# EAGLE design D9X_v41 (EAGLE 6.4)
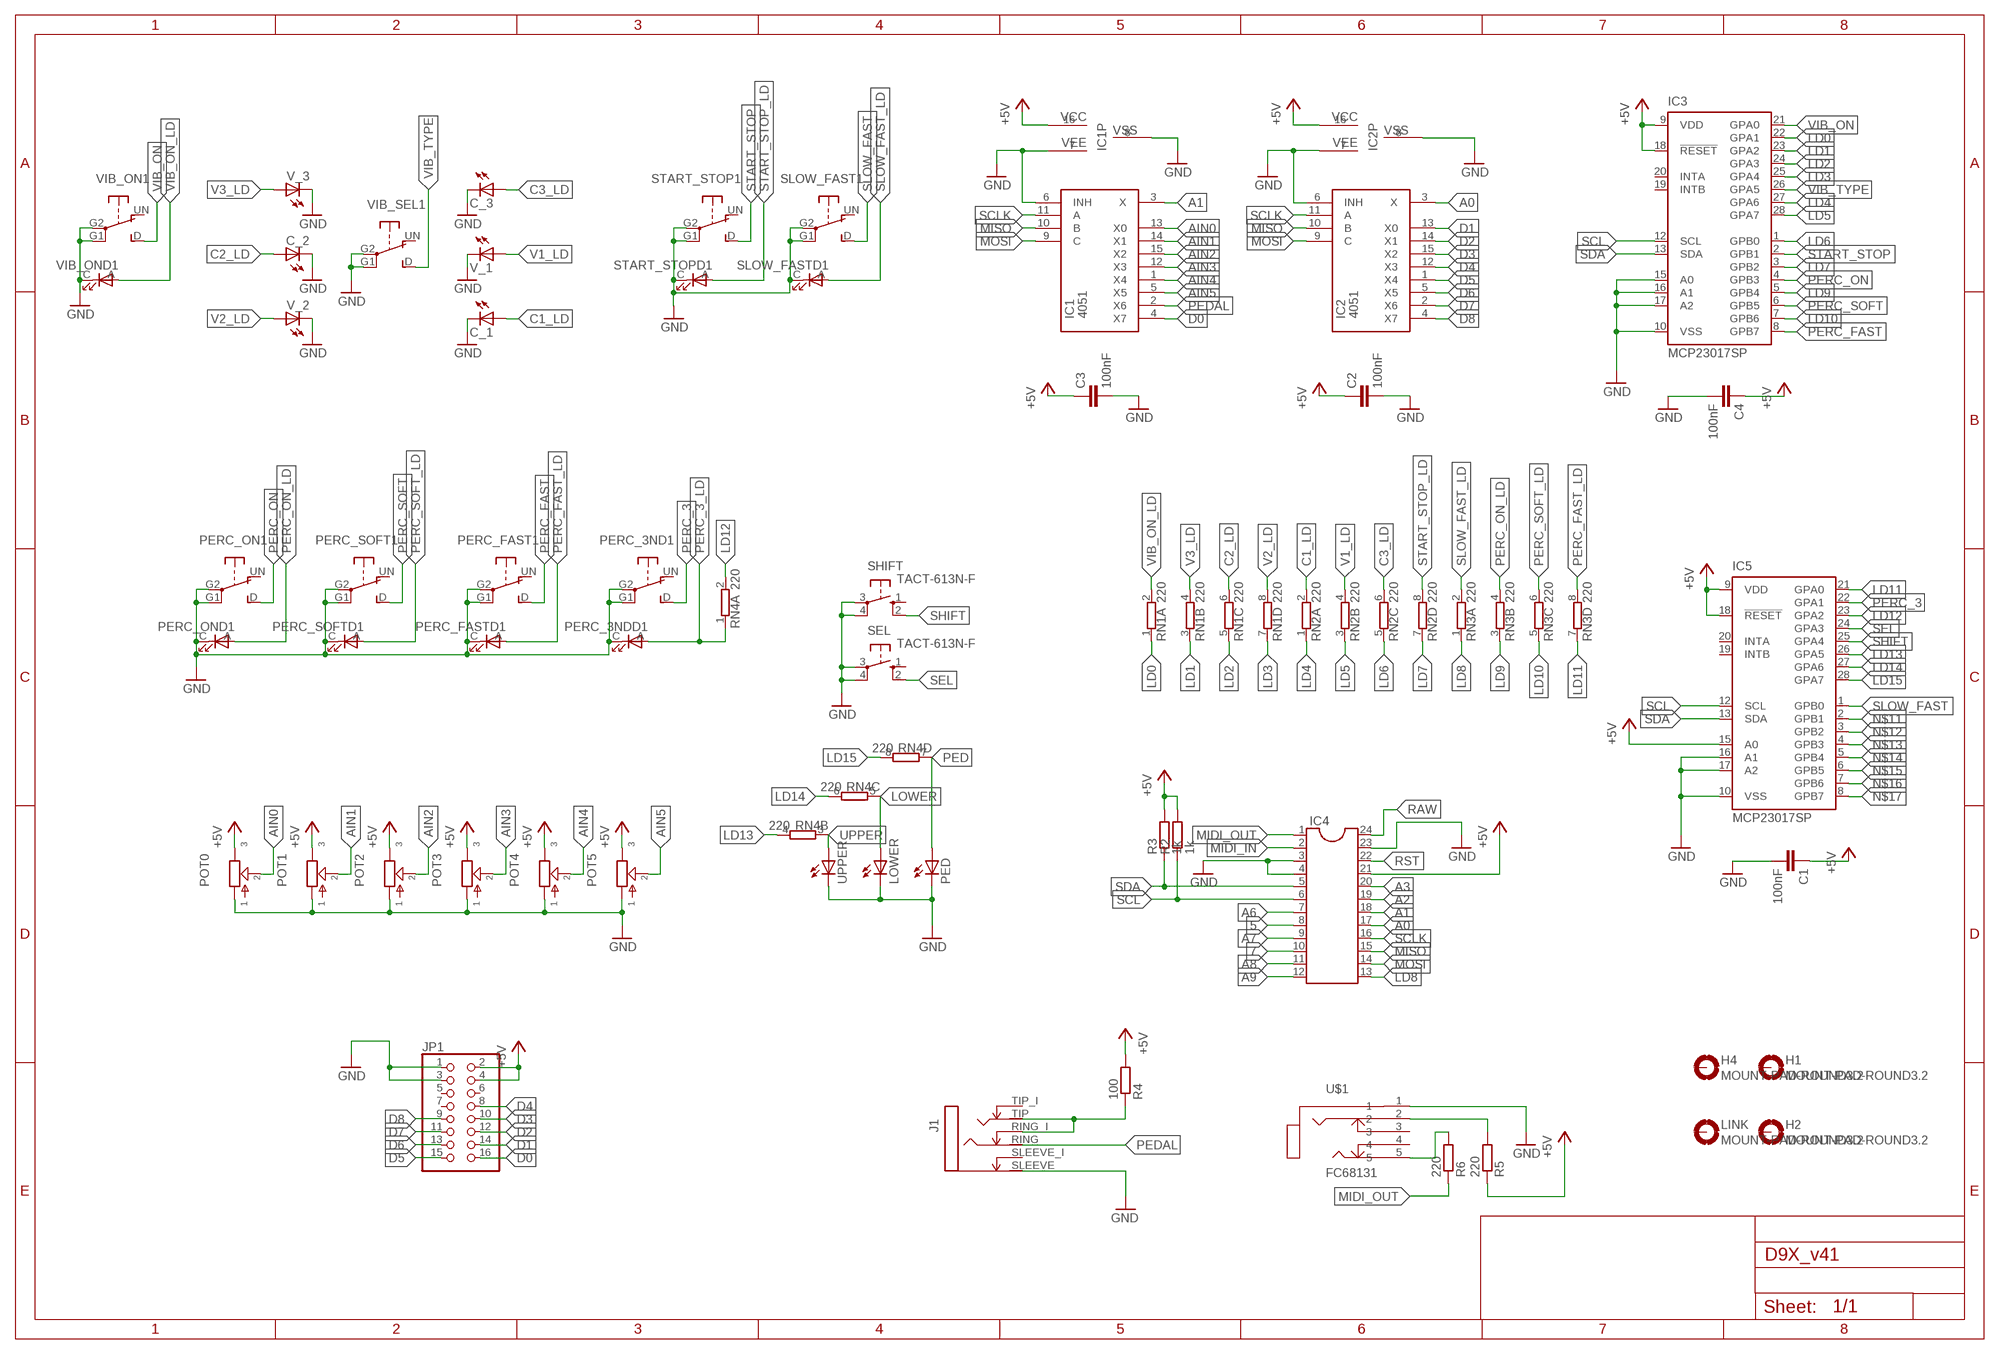
[diagram p0: schematic, sheet 1]

## Parts
C1  100nF  C-EU050-024X044  [C050-024X044]
C2  100nF  C-EU050-024X044  [C050-024X044]
C3  100nF  C-EU050-024X044  [C050-024X044]
C4  100nF  C-EU050-024X044  [C050-024X044]
C_1  LED3MM  [LED3MM]
C_2  LED3MM  [LED3MM]
C_3  LED3MM  [LED3MM]
H1  MOUNT-PAD-ROUND3.2  [3,2-PAD]
H2  MOUNT-PAD-ROUND3.2  [3,2-PAD]
H4  MOUNT-PAD-ROUND3.2  [3,2-PAD]
IC1  4051  [DIL16]
IC2  4051  [DIL16]
IC3  MCP23017SP  [DIL28-3]
IC4  DIL24-6  [DIL24-6]
IC5  MCP23017SP  [DIL28-3]
J1  STEREOSWJACK_ST_TRS_INT  [ST_JACK_TRS_INT]
JP1  PINHD-2X8  [2X08]
LINK  MOUNT-PAD-ROUND3.2  [3,2-PAD]
LOWER  LED3MM  [LED3MM]
PED  LED3MM  [LED3MM]
PERC_3ND  SRKLSHANPU  [SP86N-A1-5-01]
PERC_FAST  SRKLSHANPU  [SP86N-A1-5-01]
PERC_ON  SRKLSHANPU  [SP86N-A1-5-01]
PERC_SOFT  SRKLSHANPU  [SP86N-A1-5-01]
POT0  POT-EU12MM  [RV120DF-40B1-(L)K]
POT1  POT-EU12MM  [RV120DF-40B1-(L)K]
POT2  POT-EU12MM  [RV120DF-40B1-(L)K]
POT3  POT-EU12MM  [RV120DF-40B1-(L)K]
POT4  POT-EU12MM  [RV120DF-40B1-(L)K]
POT5  POT-EU12MM  [RV120DF-40B1-(L)K]
R2  1k  R-EU_0204/7  [0204/7]
R3  1k  R-EU_0204/7  [0204/7]
R4  100  R-EU_0204/7  [0204/7]
R5  220  R-EU_0204/7  [0204/7]
R6  220  R-EU_0204/7  [0204/7]
RN1  220  E4R  [SIL8]
RN2  220  E4R  [SIL8]
RN3  220  E4R  [SIL8]
RN4  220  E4R  [SIL8]
SEL  TACT-613N-F  10-XX  [B3F-10XX]
SHIFT  TACT-613N-F  10-XX  [B3F-10XX]
SLOW_FAST  SRKLSHANPU  [SP86N-A1-5-01]
START_STOP  SRKLSHANPU  [SP86N-A1-5-01]
U$1  FC68131  [FC68131-5P]
UPPER  LED3MM  [LED3MM]
V_1  LED3MM  [LED3MM]
V_2  LED3MM  [LED3MM]
V_3  LED3MM  [LED3MM]
VIB_ON  SRKLSHANPU  [SP86N-A1-5-01]
VIB_SEL  SRKLSHANPU  [SP86N-A1-5-01]

## Nets
5: IC4.8
7: IC4.10
+5V [5v]: C1.1 C2.1 C3.1 C4.1 IC1.16(VCC) IC2.16(VCC) IC3.9(VDD) IC3.18(!RESET) IC4.21 IC5.9(VDD) IC5.15(A0) IC5.18(!RESET) JP1.2 JP1.4 POT0.3 POT1.3 POT2.3 POT3.3 POT4.3 POT5.3 R2.2 R3.2 R4.2 R5.1
A0: IC2.3(X) IC4.17
A1: IC1.3(X) IC4.18
A2: IC4.19
A3: IC4.20
A6: IC4.7
A7: IC4.9
A8: IC4.11
A9: IC4.12
AIN0: IC1.13(X0) POT0.2
AIN1: IC1.14(X1) POT1.2
AIN2: IC1.15(X2) POT2.2
AIN3: IC1.12(X3) POT3.2
AIN4: IC1.1(X4) POT4.2
AIN5: IC1.5(X5) POT5.2
C1_LD: C_1.A RN2.2
C2_LD: C_2.A RN1.6
C3_LD: C_3.A RN2.6
D0: IC1.4(X7) JP1.16
D1: IC2.13(X0) JP1.14
D2: IC2.14(X1) JP1.12
D3: IC2.15(X2) JP1.10
D4: IC2.12(X3) JP1.8
D5: IC2.1(X4) JP1.15
D6: IC2.5(X5) JP1.13
D7: IC2.2(X6) JP1.11
D8: IC2.4(X7) JP1.9
GND [GND]: C1.2 C2.2 C3.2 C4.2 C_1.K(C) C_2.K(C) C_3.K(C) IC1.6(INH) IC1.7(VEE) IC1.8(VSS) IC2.6(INH) IC2.7(VEE) IC2.8(VSS) IC3.10(VSS) IC3.15(A0) IC3.16(A1) IC3.17(A2) IC4.3 IC4.4 IC4.23 IC5.10(VSS) IC5.16(A1) IC5.17(A2) J1.SLEEVE(S) JP1.1 JP1.3 LOWER.K(C) PED.K(C) PERC_3ND.C(D1:C) PERC_3ND.G1(1:P) PERC_3ND.G2(1:P) PERC_FAST.C(D1:C) PERC_FAST.G1(1:P) PERC_FAST.G2(1:P) PERC_ON.C(D1:C) PERC_ON.G1(1:P) PERC_ON.G2(1:P) PERC_SOFT.C(D1:C) PERC_SOFT.G1(1:P) PERC_SOFT.G2(1:P) POT0.1 POT1.1 POT2.1 POT3.1 POT4.1 POT5.1 SEL.3(P) SEL.4(P1) SHIFT.3(P) SHIFT.4(P1) SLOW_FAST.C(D1:C) SLOW_FAST.G1(1:P) SLOW_FAST.G2(1:P) START_STOP.C(D1:C) START_STOP.G1(1:P) START_STOP.G2(1:P) U$1.1 UPPER.K(C) V_1.K(C) V_2.K(C) V_3.K(C) VIB_ON.C(D1:C) VIB_ON.G1(1:P) VIB_ON.G2(1:P) VIB_SEL.G1(1:P) VIB_SEL.G2(1:P)
LD0: IC3.22(GPA1) RN1.1
LD1: IC3.23(GPA2) RN1.3
LD2: IC3.24(GPA3) RN1.5
LD3: IC3.25(GPA4) RN1.7
LD4: IC3.27(GPA6) RN2.1
LD5: IC3.28(GPA7) RN2.3
LD6: IC3.1(GPB0) RN2.5
LD7: IC3.3(GPB2) RN2.7
LD8: IC4.13 RN3.1
LD9: IC3.5(GPB4) RN3.3
LD10: IC3.7(GPB6) RN3.5
LD11: IC5.21(GPA0) RN3.7
LD12: IC5.23(GPA2) RN4.2
LD13: IC5.26(GPA5) RN4.4
LD14: IC5.27(GPA6) RN4.6
LD15: IC5.28(GPA7) RN4.8
LOWER: LOWER.A RN4.5
MIDI_IN: IC4.2
MIDI_OUT: IC4.1 R6.1
MISO: IC1.10(B) IC2.10(B) IC4.15
MOSI: IC1.9(C) IC2.9(C) IC4.14
N$1 [5v]: J1.RING_I(RN) J1.TIP(T) R4.1
N$3: R5.2 U$1.2
N$5: R6.2 U$1.5
N$11: IC5.2(GPB1)
N$12: IC5.3(GPB2)
N$13: IC5.4(GPB3)
N$14: IC5.5(GPB4)
N$15: IC5.6(GPB5)
N$16: IC5.7(GPB6)
N$17: IC5.8(GPB7)
PED: PED.A RN4.7
PEDAL: IC1.2(X6) J1.RING(R)
PERC_3: IC5.22(GPA1) PERC_3ND.D(1:S)
PERC_3_LD: PERC_3ND.A(D1:A) RN4.1
PERC_FAST: IC3.8(GPB7) PERC_FAST.D(1:S)
PERC_FAST_LD: PERC_FAST.A(D1:A) RN3.8
PERC_ON: IC3.4(GPB3) PERC_ON.D(1:S)
PERC_ON_LD: PERC_ON.A(D1:A) RN3.4
PERC_SOFT: IC3.6(GPB5) PERC_SOFT.D(1:S)
PERC_SOFT_LD: PERC_SOFT.A(D1:A) RN3.6
RAW: IC4.24
RST: IC4.22
SCL: IC3.12(SCL) IC4.6 IC5.12(SCL) R2.1
SCLK: IC1.11(A) IC2.11(A) IC4.16
SDA: IC3.13(SDA) IC4.5 IC5.13(SDA) R3.1
SEL: IC5.24(GPA3) SEL.2(S1)
SHIFT: IC5.25(GPA4) SHIFT.2(S1)
SLOW_FAST: IC5.1(GPB0) SLOW_FAST.D(1:S)
SLOW_FAST_LD: RN3.2 SLOW_FAST.A(D1:A)
START_STOP: IC3.2(GPB1) START_STOP.D(1:S)
START_STOP_LD: RN2.8 START_STOP.A(D1:A)
UPPER: RN4.3 UPPER.A
V1_LD: RN2.4 V_1.A
V2_LD: RN1.8 V_2.A
V3_LD: RN1.4 V_3.A
VIB_ON: IC3.21(GPA0) VIB_ON.D(1:S)
VIB_ON_LD: RN1.2 VIB_ON.A(D1:A)
VIB_TYPE: IC3.26(GPA5) VIB_SEL.D(1:S)
Unconnected: H1.B3,2(MOUNT) H2.B3,2(MOUNT) H4.B3,2(MOUNT) IC3.19(INTB) IC3.20(INTA) IC5.19(INTB) IC5.20(INTA) J1.SLEEVE_I(SN) J1.TIP_I(TN) JP1.5 JP1.6 JP1.7 LINK.B3,2(MOUNT) PERC_3ND.UN(1:O) PERC_FAST.UN(1:O) PERC_ON.UN(1:O) PERC_SOFT.UN(1:O) SEL.1(S) SHIFT.1(S) SLOW_FAST.UN(1:O) START_STOP.UN(1:O) U$1.3 U$1.4 VIB_ON.UN(1:O) VIB_SEL.A(D1:A) VIB_SEL.C(D1:C) VIB_SEL.UN(1:O)

## Library data of the parts
C1-C4 = rcl:C-EU: CAPACITOR, European symbol
C_1-C_3 LOWER PED UPPER V_1-V_3 = led:LED: LED OSRAM: - CHIPLED LG R971, LG N971, LY N971, LG Q971, LY Q971, LO R971, LY R971 LH N974, LH R974 LS Q976, LO Q976, LY Q976 LO Q996 - Hyper CHIPLED LW Q18S LB Q993, LB Q99A, LB R99A - SideLED LS A670, LO A670, LY A670, LG A670, LP A670 LB A673, LV A673, LT A673, LW A673 LH A674 LY A675 LS A676, LA A676, LO A676, LY A676, LW A676 LS A679, LY A679, LG A679 - Hyper Micro SIDELED® LS Y876, LA Y876, LO Y876, LY Y876 LT Y87S - SmartLED LW L88C, LW L88S LB L89C, LB L89S, LG L890 LS L89K, LO L89K, LY L89K LS L896, LA L896, LO L896, LY L896 - TOPLED LS T670, LO T670, LY T670, LG T670, LP T670 LSG T670, LSP T670, LSY T670, LOP T670, LYG T670 LG T671, LOG T671, LSG T671 LB T673, LV T673, LT T673, LW T673 LH T674 LS T676, LA T676, LO T676, LY T676, LB T676, LH T676, LSB T676, LW T676 LB T67C, LV T67C, LT T67C, LS T67K, LO T67K, LY T67K, LW E67C LS E67B, LA E67B, LO E67B, LY E67B, LB E67C, LV E67C, LT E67C LW T67C LS T679, LY T679, LG T679 LS T770, LO T770, LY T770, LG T770, LP T770 LB T773, LV T773, LT T773, LW T773 LH T774 LS E675, LA E675, LY E675, LS T675 LS T776, LA T776, LO T776, LY T776, LB T776 LHGB T686 LT T68C, LB T68C - Hyper Mini TOPLED® LB M676 - Mini TOPLED Santana® LG M470 LS M47K, LO M47K, LY M47K Source: http://www.osram.convergy.de LUXEON: - LUMILED® LXK2-PW12-R00, LXK2-PW12-S00, LXK2-PW14-U00, LXK2-PW14-V00 LXK2-PM12-R00, LXK2-PM12-S00, LXK2-PM14-U00 LXK2-PE12-Q00, LXK2-PE12-R00, LXK2-PE12-S00, LXK2-PE14-T00, LXK2-PE14-U00 LXK2-PB12-K00, LXK2-PB12-L00, LXK2-PB12-M00, LXK2-PB14-N00, LXK2-PB14-P00, LXK2-PB14-Q00 LXK2-PR12-L00, LXK2-PR12-M00, LXK2-PR14-Q00, LXK2-PR14-R00 LXK2-PD12-Q00, LXK2-PD12-R00, LXK2-PD12-S00 LXK2-PH12-R00, LXK2-PH12-S00 LXK2-PL12-P00, LXK2-PL12-Q00, LXK2-PL12-R00 Source: www.luxeon.com KINGBRIGHT: KA-3528ASYC Source: www.kingbright.com
H1 H2 H4 LINK = holes:MOUNT-PAD-ROUND: MOUNTING PAD, round
IC1 IC2 = atari:4051: 8-Channel Analog Multiplexer/Demultiplexer
IC3 IC5 = microchip:MCP23017: http://ww1.microchip.com/downloads/en/DeviceDoc/21952a.pdf Source: http://ww1.microchip.com/downloads/en/DeviceDoc/21952a.pdf; MF: MICROCHIP; MPN: MCP23017-E/SP; OC_FARNELL: 1332088; OC_NEWARK: 31K2959
IC4 = ic-package:DIL24: Dual In Line
J1 = jacks:STEREOSW
JP1 = pinhead:PINHD-2X8: PIN HEADER
PERC_3ND PERC_FAST PERC_ON PERC_SOFT SLOW_FAST START_STOP VIB_ON VIB_SEL = switch-misc:SRKL: SWITCH
POT0 POT1-POT5 = gm-pots:POT-EU
R2-R6 = rcl:R-EU_: RESISTOR, European symbol
RN1-RN4 = resistor-sil:E4R: SIL RESISTOR; OC_FARNELL: unknown; OC_NEWARK: unknown
SEL SHIFT = switch-omron:10-XX: OMRON SWITCH; MPN: B3F-1000; OC_FARNELL: 176432; OC_NEWARK: 36M3542
U$1 = con-cliff:FC68131

## Net classes
0 default: width 0.254 mm, drill 0.152 mm, clearance 0.254 mm
1 5v: width 0.508 mm, drill 0.152 mm, clearance 0.406 mm
2 GND: width 0.635 mm, drill 0.152 mm, clearance 0.635 mm

## Board
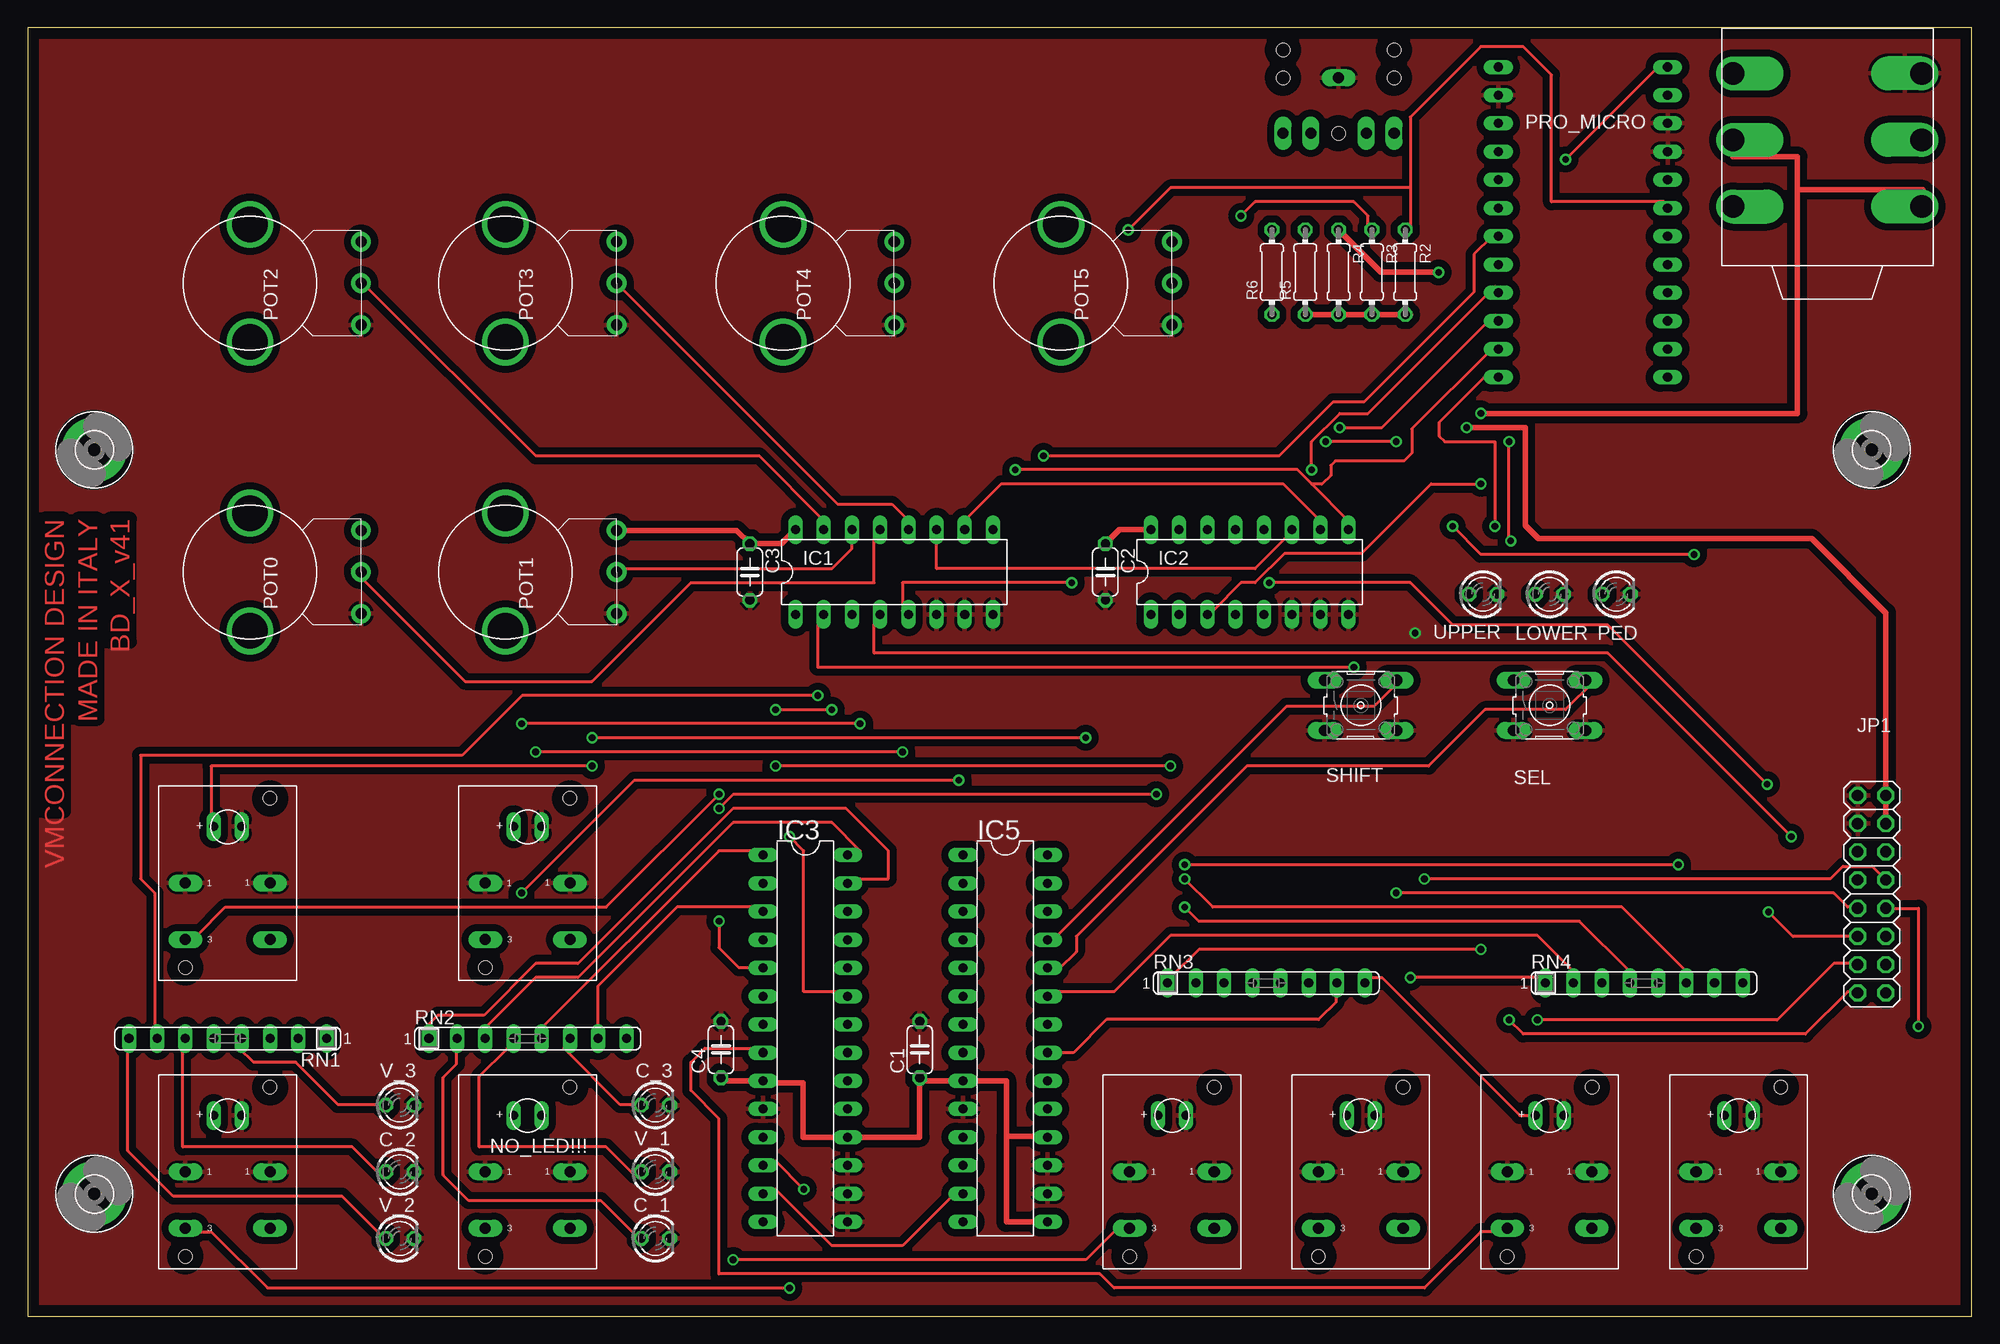
[diagram p1: board, top side]
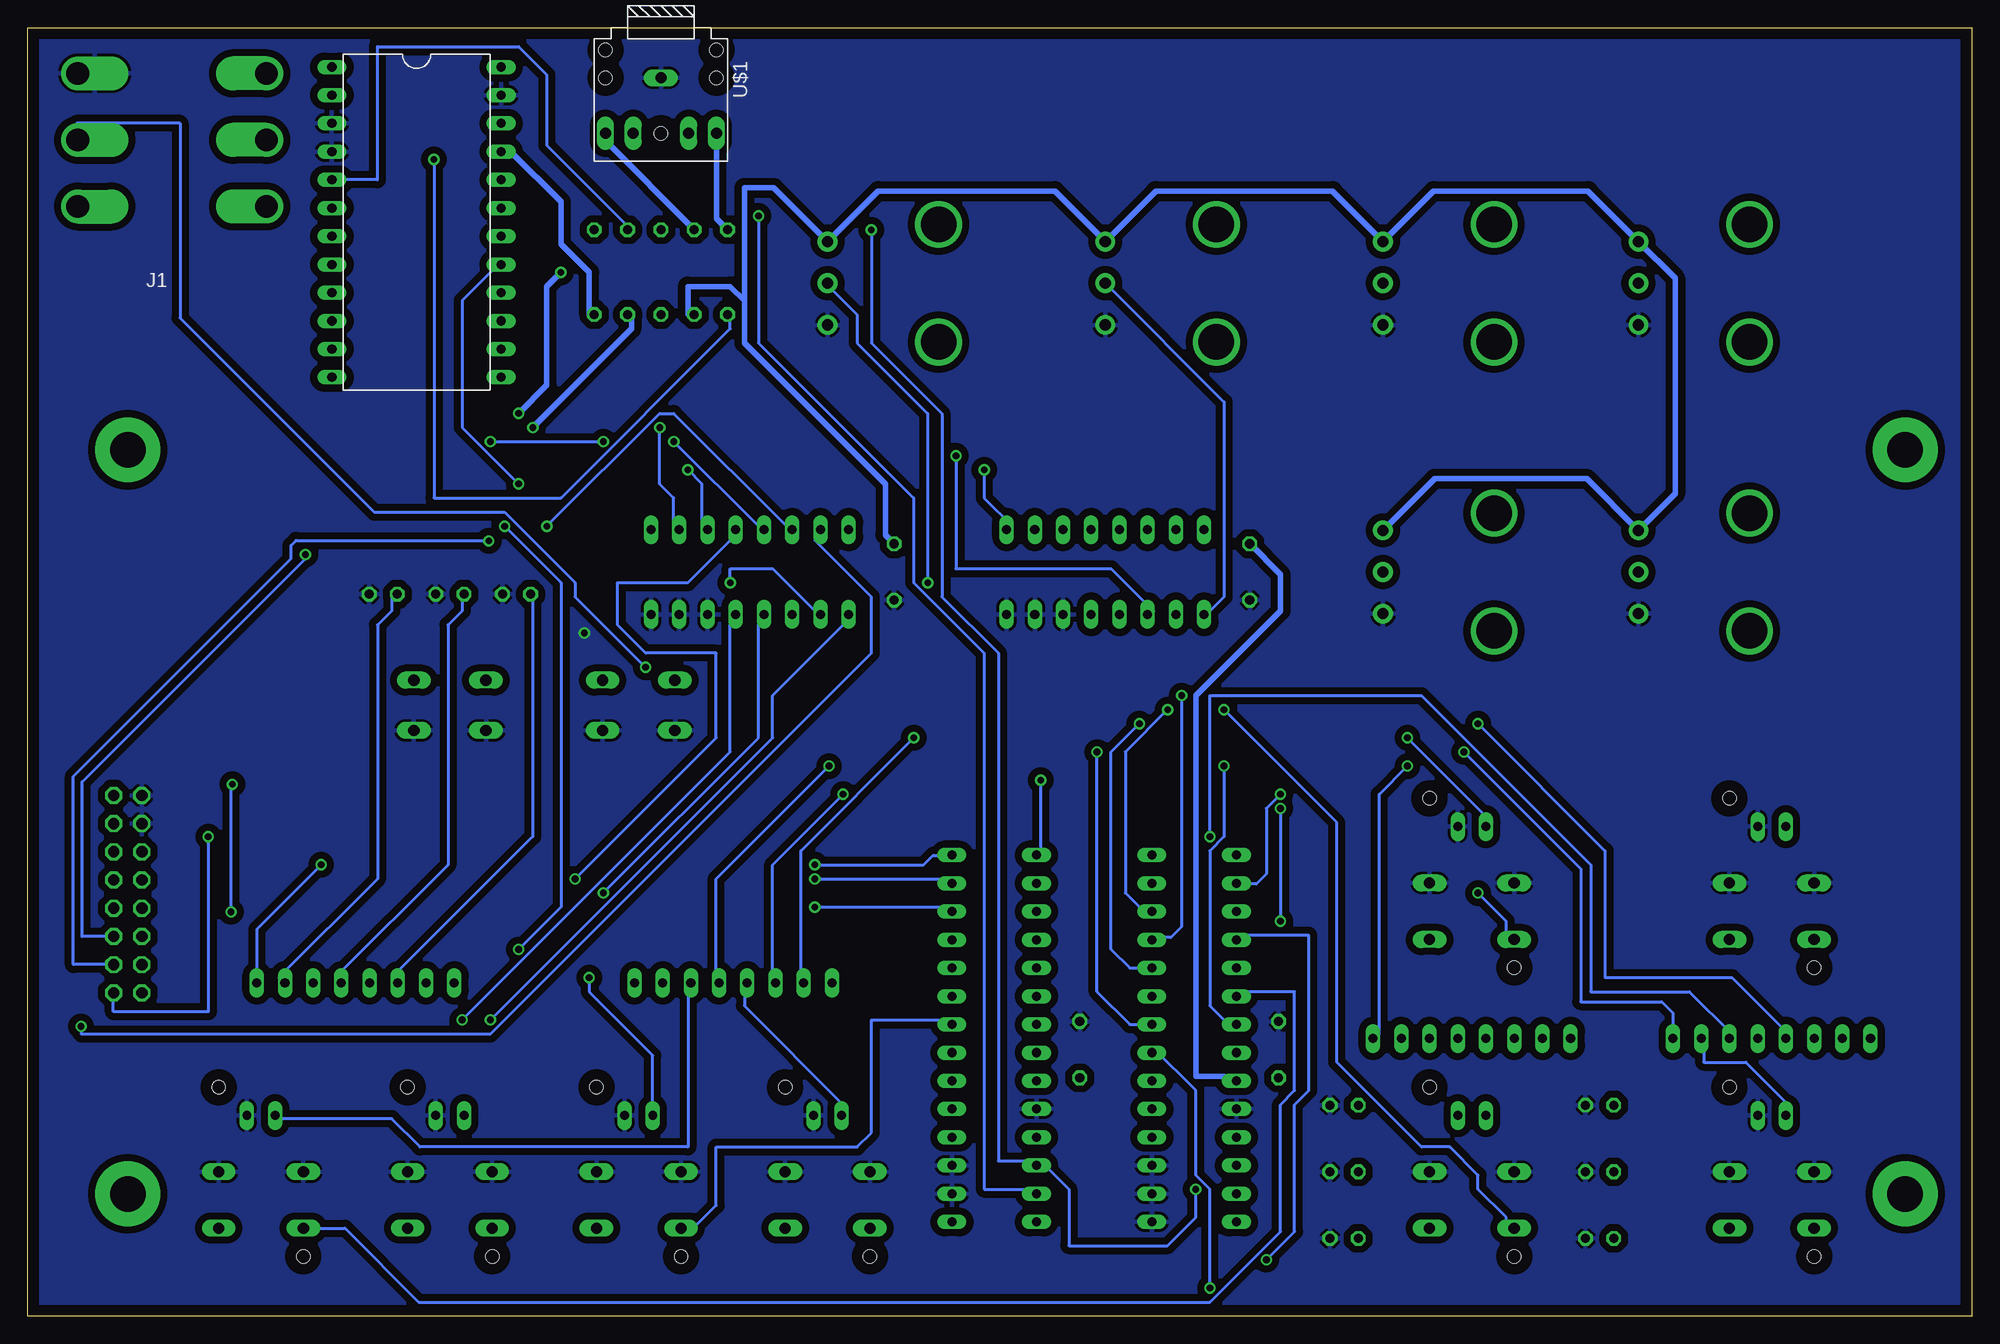
[diagram p2: board, bottom side, seen from below]

Size 175 x 116 mm. Coordinates in mm from the lower left corner, seen from the top.
Outline: 0,0 175,0 175,116 0,116 0,0
Copper layers (1*16): Top 0.035mm / dielectric 1.5mm / Bottom 0.035mm
Design rules "default": minimum track width 10mil, minimum drill 24mil, track to track 8mil, track to pad 8mil, pad to pad 8mil, via to via 8mil, smd to smd 8mil, copper to edge 40mil, drill to drill 8mil, minimum pad ring 10mil, minimum via ring 8mil, stop-mask expansion 4mil, vias tented up to drill 0mil, thermal gap 10mil

### Footprints (pad centres in the part's own frame; a part is rotated, then mirrored left to right if it is on the bottom)
C050-024X044 = drill 0.813 octagon: 1 -2.54,0; 2 2.54,0
LED3MM = drill 0.813 octagon: A -1.27,0; K 1.27,0
3,2-PAD = drill 3.2 pad 5.842: B3,2 0,0
DIL16 = drill 0.813 long: 1 -8.89,-3.81; 2 -6.35,-3.81; 3 -3.81,-3.81; 4 -1.27,-3.81; 5 1.27,-3.81; 6 3.81,-3.81; 7 6.35,-3.81; 8 8.89,-3.81; 9 8.89,3.81; 10 6.35,3.81; 11 3.81,3.81; 12 1.27,3.81; 13 -1.27,3.81; 14 -3.81,3.81; 15 -6.35,3.81; 16 -8.89,3.81
DIL28-3 = drill 0.813 long: 1 -16.51,-3.81; 2 -13.97,-3.81; 3 -11.43,-3.81; 4 -8.89,-3.81; 5 -6.35,-3.81; 6 -3.81,-3.81; 7 -1.27,-3.81; 8 1.27,-3.81; 9 3.81,-3.81; 10 6.35,-3.81; 11 8.89,-3.81; 12 11.43,-3.81; 13 13.97,-3.81; 14 16.51,-3.81; 15 16.51,3.81; 16 13.97,3.81; 17 11.43,3.81; 18 8.89,3.81; 19 6.35,3.81; 20 3.81,3.81; 21 1.27,3.81; 22 -1.27,3.81; 23 -3.81,3.81; 24 -6.35,3.81; 25 -8.89,3.81; 26 -11.43,3.81; 27 -13.97,3.81; 28 -16.51,3.81
DIL24-6 = drill 0.813 long: 1 -13.97,-7.62; 2 -11.43,-7.62; 3 -8.89,-7.62; 4 -6.35,-7.62; 5 -3.81,-7.62; 6 -1.27,-7.62; 7 1.27,-7.62; 8 3.81,-7.62; 9 6.35,-7.62; 10 8.89,-7.62; 11 11.43,-7.62; 12 13.97,-7.62; 13 13.97,7.62; 14 11.43,7.62; 15 8.89,7.62; 16 6.35,7.62; 17 3.81,7.62; 18 1.27,7.62; 19 -1.27,7.62; 20 -3.81,7.62; 21 -6.35,7.62; 22 -8.89,7.62; 23 -11.43,7.62; 24 -13.97,7.62
ST_JACK_TRS_INT = drill 2.032 offset: RING 8.5,0; RING_I -8.5,0; SLEEVE 8.5,-6; SLEEVE_I -8.5,-6; TIP 8.5,6; TIP_I -8.5,6
2X08 = drill 1.016 octagon: 1 -8.89,-1.27; 2 -8.89,1.27; 3 -6.35,-1.27; 4 -6.35,1.27; 5 -3.81,-1.27; 6 -3.81,1.27; 7 -1.27,-1.27; 8 -1.27,1.27; 9 1.27,-1.27; 10 1.27,1.27; 11 3.81,-1.27; 12 3.81,1.27; 13 6.35,-1.27; 14 6.35,1.27; 15 8.89,-1.27; 16 8.89,1.27
SP86N-A1-5-01 = drill 0.8 long: A -1.27,5.08; C 1.27,5.08 | drill 1 long: D -3.81,-5.08; G1 -3.81,0; G2 3.81,0; UN 3.81,-5.08 | hole 1.2: 3.81,7.62; -3.81,-7.62
RV120DF-40B1-(L)K = drill 1 pad 1.778: 1 -3.75,-10; 2 0,-10; 3 3.75,-10 | drill 3.2: P$4 -5.3,0; P$5 5.3,0
0204/7 = drill 0.813 octagon: 1 -3.81,0; 2 3.81,0
SIL8 = drill 0.813 long: 1 -8.89,0; 2 -6.35,0; 3 -3.81,0; 4 -1.27,0; 5 1.27,0; 6 3.81,0; 7 6.35,0; 8 8.89,0
B3F-10XX = drill 1.016 long: 1 -3.251,2.261; 2 3.251,2.261; 3 -3.251,-2.261; 4 3.251,-2.261
FC68131-5P = drill 1 long: 1 -5,0; 2 0,-5; 3 0,-2.5; 4 0,2.5; 5 0,5 | hole 1.2: 0,0; -5,-5; -5,5; -7.5,5; -7.5,-5

### Placement (x,y rotation side)
C1  80.3,24 90 top
C2  97,67 270 top
C3  65,67 270 top
C4  62.4,24 90 top
C_1  56.5,7 0 top
C_2  33.5,13 0 top
C_3  56.5,19 0 top
H1  6,11 0 top
H2  166,11 0 top
H4  6,78 0 top
IC1  78,67 0 top
IC2  110,67 0 top
IC3  70,25 270 top
IC4  140,98.5 270 bottom
IC5  88,25 270 top
J1  162,105.9 180 bottom
JP1  166,38 270 top
LINK  166,78 0 top
LOWER  137,65 0 top
PED  143,65 0 top
PERC_3ND  120,13 0 top
PERC_FAST  137,13 0 top
PERC_ON  103,13 0 top
PERC_SOFT  154,13 0 top
POT0  20,67 90 top
POT1  43,67 90 top
POT2  20,93 90 top
POT3  43,93 90 top
POT4  68,93 90 top
POT5  93,93 90 top
R2  124,94 270 top
R3  121,94 270 top
R4  118,94 270 top
R5  115,94 90 top
R6  112,94 90 top
RN1  18,25 180 top
RN2  45,25 0 top
RN3  111.5,30 0 top
RN4  145.5,30 0 top
SEL  137,55 0 top
SHIFT  120,55 0 top
SLOW_FAST  45,39 0 top
START_STOP  18,39 0 top
U$1  118,106.5 270 bottom
UPPER  131,65 0 top
V_1  56.5,13 0 top
V_2  33.5,7 0 top
V_3  33.5,19 0 top
VIB_ON  18,13 0 top
VIB_SEL  45,13 0 top

### Tracks (layer width: path | path; a pad name or v marks a point on that pad's centre or on a via)
+5V  (via drill 0.61)
  Top 0.508: 118.11,90.17 115.57,90.17 R5.1 | 118.11,90.17 120.65,90.17 | 118.11,90.17 R4.2 | 120.65,90.17 124.46,90.17 R2.2 | 120.65,90.17 R3.2 | v129.54,80.01 134.8,80.01 134.8,71.2 136,70 160.6,70 167.27,63.33 JP1.2 JP1.4 | C4.1 62.67,21.19 IC3.9 66.19,21 69.8,21 69.8,16.11 IC3.18 80.3,16.11 C1.1 80.3,21.19 IC5.9 88.1,21.19 88.1,16.2 | 88.1,16.2 91.81,16.2 IC5.18 | IC5.15 88.1,8.49 88.1,16.2 | IC2.16 98.27,70.81 C2.1 | 64.9,69.64 C3.1 | IC1.16 67.84,69.54 C3.1 | POT1.3 63.79,70.75 C3.1
  Bottom 0.508: R2.2 124.46,90.17 124.46,93.98 127,96.52 127,100.33 131.52,104.85 IC4.21 | v129.54,80.01 120.65,88.9 120.65,90.17 R3.2 | 110.49,91.44 110.49,87.63 97.79,74.93 97.79,70.33 C2.1 | 110.49,91.44 111.76,92.71 115.57,92.71 115.57,90.17 R5.1 | 110.49,91.44 110.49,101.6 107.85,101.6 POT5.3 98.45,101.3 82.55,101.3 POT4.3 73.45,101.3 57.55,101.3 POT3.3 48.45,101.3 34.55,101.3 POT2.3 26.7,93.45 26.7,74.05 POT0.3 34.65,75.4 48.35,75.4 POT1.3 | IC3.9 67.31,21.59 69.85,21.59 69.85,55.88 62.23,63.5 62.23,66.77 C3.1
A0  (via drill 0.61)
  Top 0.254: IC2.3 106.68,63.5 109.22,66.04 110.49,66.04 113.15,68.7 120.1,68.7 126.33,74.93 v130.81,74.93
  Bottom 0.254: v130.81,74.93 135.89,80.01 135.89,91.44 132.64,94.69 IC4.17
A1  (via drill 0.61)
  Top 0.254: v91.44,77.47 112.67,77.47 117.5,82.3 120.3,82.3 130.2,92.2 130.2,95.6 131.8,97.2 132.35,97.2 IC4.18
  Bottom 0.254: v91.44,77.47 91.44,67.31 77.47,67.31 73.66,63.5 IC1.3
AIN0
  Top 0.254: IC1.13 76.2,69.85 76.2,66.04 59.69,66.04 50.8,57.15 39.37,57.15 29.21,67.31 POT0.2
AIN1
  Top 0.254: POT1.2 53.34,67.31 72.39,67.31 74.19,69.11 IC1.14
AIN2
  Top 0.254: POT2.2 30.48,92.71 45.72,77.47 65.83,77.47 71.65,71.65 IC1.15
AIN3
  Top 0.254: POT3.2 72.9,73.1 77.8,73.1 79.27,71.63 IC1.12
AIN4
  Bottom 0.254: IC1.1 68.58,63.5 67.31,64.77 67.31,82.31 POT4.2
AIN5  (via drill 0.61)
  Top 0.254: v93.98,66.04 78.74,66.04 78.74,63.5 IC1.5
  Bottom 0.254: v93.98,66.04 93.98,81.28 100.33,87.63 100.33,90.17 102.87,92.71 POT5.2
C1_LD
  Top 0.254: C_1.A 55,7 51.6,10.4 39.7,10.4 37.4,12.7 37.4,21.5 38.6,22.7 38.6,24.95 RN2.2
C2_LD
  Top 0.254: RN1.6 13.97,24.13 13.97,15.24 29.21,15.24 31.75,12.7 C_2.A
C3_LD
  Top 0.254: RN2.6 48.26,24.13 53.34,19.05 54.61,19.05 C_3.A
D0  (via drill 0.61)
  Top 0.254: v158.75,43.18 142.24,59.69 76.2,59.69 76.2,62.23 IC1.4
  Bottom 0.254: v158.75,43.18 158.75,27.4 167.3,27.4 167.3,29.11 JP1.16
D1  (via drill 0.6, 0.61)
  Top 0.254: v123.19,78.74 v116.84,78.74 | v133.5,69.8 133.35,69.8 v133.35,78.74
  Bottom 0.254: v116.84,78.74 109.22,71.12 IC2.13 | v133.35,78.74 v123.19,78.74 | v133.5,69.8 133.5,69.85 150.85,69.85 151.3,69.4 151.3,68.2 170.9,48.6 170.9,31.65 JP1.14
D2  (via drill 0.61)
  Top 0.254: v128.27,71.12 130.81,68.58 v150,68.58
  Bottom 0.254: v128.27,71.12 118.11,81.28 116.84,81.28 106.68,71.12 IC2.14 | JP1.12 170.1,34.19 170.1,48.1 150,68.2 v150,68.58
D3  (via drill 0.6)
  Top 0.254: JP1.10 170.2,36.73 v170.2,26.1
  Bottom 0.254: IC2.15 104.14,69.85 99.06,64.77 99.06,59.69 133.35,25.4 170.18,25.4 170.2,25.42 v170.2,26.1
D4  (via drill 0.61)
  Top 0.254: v125.73,39.37 162.27,39.37 163.4,40.5 166.04,40.5 JP1.8
  Bottom 0.254: v125.73,39.37 113.03,52.07 113.03,59.69 119.38,59.69 121.92,62.23 121.92,66.04 115.57,66.04 111.76,69.85 IC2.12
D5  (via drill 0.61)
  Top 0.254: v133.35,26.67 134.62,25.4 160.02,25.4 163.83,29.21 165.1,29.21 JP1.15
  Bottom 0.254: v133.35,26.67 107.95,52.07 107.95,55.88 101.6,62.23 IC2.1
D6  (via drill 0.61)
  Top 0.254: v135.89,26.67 157.48,26.67 162.56,31.75 165.1,31.75 JP1.13
  Bottom 0.254: v135.89,26.67 111.76,50.8 111.76,62.23 IC2.5
D7  (via drill 0.6, 0.61)
  Top 0.254: v111.76,66.04 124.46,66.04 128.27,62.23 142.24,62.23 v156.59,47.88 156.78,47.69 | JP1.11 158.91,34.19 v156.7,36.4
  Bottom 0.254: v111.76,66.04 111.76,67.31 107.95,67.31 104.14,63.5 IC2.2 | v156.7,36.4 156.7,47.77 v156.59,47.88
D8  (via drill 0.61)
  Top 0.254: v123.19,38.1 162.56,38.1 163.83,36.83 165.1,36.83 JP1.9
  Bottom 0.254: v123.19,38.1 109.22,52.07 109.22,62.23 IC2.4
GND  (via drill 0.6)
  other vias: 124.9,61.5
  pour Top (isolate 0.406): 0,0 175,0 175,116 0,116
  pour Bottom (isolate 0.406): 0,0 175,0 175,116 0,116
LD0  (via drill 0.61)
  Top 0.254: v78.74,50.8 v45.72,50.8
  Bottom 0.254: v45.72,50.8 35.2,40.28 35.2,28.3 27.9,28.3 26.9,27.3 RN1.1 | v78.74,50.8 78.74,29.21 75.8,26.27 IC3.22
LD1  (via drill 0.61)
  Top 0.254: v68.58,43.18 69.85,41.91 69.85,29.21 73.66,29.21 IC3.23
  Bottom 0.254: v68.58,43.18 68.58,55.88 49.53,55.88 34.29,40.64 34.29,29.21 25.4,29.21 21.59,25.4 RN1.3
LD2  (via drill 0.61)
  Top 0.254: v74.93,53.34 v44.45,53.34
  Bottom 0.254: v44.45,53.34 33.02,41.91 33.02,30.48 21.59,30.48 16.51,25.4 RN1.5 | v74.93,53.34 77.47,50.8 77.47,33.02 75.8,31.35 IC3.24
LD3  (via drill 0.61)
  Top 0.254: RN1.7 11.43,25.4 11.43,38.1 10.16,39.37 10.16,50.5 39.1,50.5 44.48,55.88 v71.12,55.88
  Bottom 0.254: v71.12,55.88 71.12,35.08 72.1,34.1 73.6,34.1 IC3.25
LD4
  Top 0.254: IC3.27 74.93,39.37 77.47,39.37 77.47,41.91 73.66,45.72 63.5,45.72 49.53,31.75 45.72,31.75 41.07,27.1 36.9,27.1 36.11,26.31 RN2.1
LD5
  Top 0.254: RN2.3 40.64,25.4 45.72,30.48 49.53,30.48 63.5,44.45 72.39,44.45 74.93,41.91 IC3.28
LD6
  Top 0.254: RN2.5 45.72,25.4 62.23,41.91 66.04,41.91 IC3.1
LD7
  Top 0.254: IC3.3 66.04,36.83 58.43,36.83 51.35,29.75 RN2.7
LD8  (via drill 0.61)
  Top 0.254: v130.81,33.02 105.41,33.02 102.87,30.48 RN3.1 | v132.08,71.12 132.08,78.74 127.56,78.74 127.1,79.2 127.1,80.5 131.13,84.53 IC4.13
  Bottom 0.254: v130.81,33.02 127,36.83 127,66.04 v132.08,71.12
LD9  (via drill 0.61)
  Top 0.254: v62.23,45.72 63.5,46.99 v101.6,46.99 | v62.23,35.56 62.23,33.17 64,31.4 66.14,31.4 IC3.5
  Bottom 0.254: v62.23,45.72 v62.23,35.56 | v101.6,46.99 107.95,40.64 107.95,30.48 RN3.3
LD10  (via drill 0.61)
  Top 0.254: v102.87,49.53 v67.31,49.53
  Bottom 0.254: v67.31,49.53 67.31,43.18 68.58,41.91 68.58,27.94 67.31,26.67 IC3.7 | v102.87,49.53 113.03,39.37 113.03,30.48 RN3.5
LD11
  Top 0.254: RN3.7 117.8,29.95 117.8,28.3 116.2,26.7 97.1,26.7 94.13,23.73 IC5.21
LD12
  Top 0.254: IC5.23 92.71,29.21 97.79,29.21 102.87,34.29 135.89,34.29 139.15,31.03 RN4.2
LD13  (via drill 0.61)
  Top 0.254: v104.14,36.83 105.41,35.56 139.7,35.56 144.23,31.03 RN4.4
  Bottom 0.254: v104.14,36.83 92.71,36.83 IC5.26
LD14  (via drill 0.61)
  Top 0.254: v104.14,39.37 106.68,36.83 143.51,36.83 149.31,31.03 RN4.6
  Bottom 0.254: v104.14,39.37 92.71,39.37 IC5.27
LD15  (via drill 0.61)
  Top 0.254: v148.59,40.64 v104.14,40.64
  Bottom 0.254: v148.59,40.64 154.39,34.84 RN4.8 | v104.14,40.64 94.36,40.64 93.5,41.5 IC5.28
LOWER
  Bottom 0.254: RN4.5 147.32,30.48 137.16,40.64 137.16,62.23 135.89,63.5 135.89,64.77 LOWER.A
MIDI_OUT  (via drill 0.61)
  Top 0.254: v138.43,104.14 146.76,112.47 IC4.1
  Bottom 0.254: v138.43,104.14 138.43,73.66 127,73.66 111.76,88.9 111.76,90.17 R6.1
MISO  (via drill 0.61)
  Top 0.254: IC1.10 83.82,71.12 87.63,74.93 113.03,74.93 116.35,71.61 IC2.10 | v118.11,80.01 121.92,80.01 132.08,90.17 IC4.15
  Bottom 0.254: v118.11,80.01 118.11,74.93 116.84,73.66 116.84,71.12 IC2.10
MOSI  (via drill 0.61)
  Top 0.254: v88.9,76.2 114.3,76.2 115.6,74.9 | 115.6,74.9 118.89,71.61 IC2.9 | IC4.14 132.31,87 131.7,87 124.6,79.9 124.6,77.7 123.9,77 117.7,77 117.3,76.6 117.3,75.7 116.5,74.9 115.6,74.9
  Bottom 0.254: v88.9,76.2 88.9,73.66 86.36,71.12 IC1.9
N$1  (via drill 0.61)
  Top 0.508: v127,93.98 121.83,93.98 R4.1 | v130.81,81.28 159.3,81.28 159.3,101.4 | 159.3,101.4 159.3,104.4 153.5,104.4 J1.RING_I | J1.TIP 170.6,99.9 170.6,101.4 159.3,101.4
  Bottom 0.508: v127,93.98 128.27,92.71 128.27,83.82 v130.81,81.28
N$3
  Bottom 0.508: R5.2 123,105.81 U$1.2
N$5
  Bottom 0.508: R6.2 113,98.81 U$1.5
PED
  Bottom 0.254: RN4.7 152.4,30.48 143.51,39.37 143.51,62.23 142.24,63.5 142.24,64.77 PED.A
PEDAL  (via drill 0.61)
  Top 0.254: v119.38,58.42 71.12,58.42 71.12,62.23 IC1.2
  Bottom 0.254: v119.38,58.42 125.73,64.77 125.73,66.04 132.08,72.39 143.8,72.39 161.29,89.88 161.29,107.4 170.6,107.4 170.6,105.9 J1.RING
PERC_3
  Bottom 0.254: IC5.22 92.71,26.67 99.06,26.67 99.06,16.51 100.33,15.24 113.03,15.24 113.03,9.97 115.1,7.9 116.17,7.9 PERC_3ND.D
PERC_3_LD  (via drill 0.61)
  Top 0.254: v124.46,30.48 137.16,30.48 RN4.1
  Bottom 0.254: v124.46,30.48 124.46,29.21 118.73,23.48 PERC_3ND.A
PERC_FAST
  Top 0.254: IC3.8 66.04,24.13 60.96,24.13 59.69,22.86 59.69,20.32 62.23,17.78 62.23,3.81 96.52,3.81 97.79,2.54 125.73,2.54 130.81,7.62 132.08,7.62 PERC_FAST.D
PERC_FAST_LD
  Top 0.254: RN3.8 120.65,30.48 121.92,30.48 134.32,18.08 PERC_FAST.A
PERC_ON  (via drill 0.61)
  Top 0.254: v63.5,5.08 95.25,5.08 97.79,7.62 99.06,7.62 PERC_ON.D
  Bottom 0.254: v63.5,5.08 60.96,7.62 60.96,19.05 59.69,20.32 59.69,34.29 66.04,34.29 IC3.4
PERC_ON_LD
  Bottom 0.254: PERC_ON.A 101.6,19.05 110.49,27.94 110.49,29.21 RN3.4
PERC_SOFT
  Bottom 0.254: IC3.6 66.04,29.21 60.96,29.21 60.96,20.32 62.23,19.05 62.23,7.62 68.58,1.27 139.8,1.27 146.45,7.92 PERC_SOFT.D
PERC_SOFT_LD
  Bottom 0.254: PERC_SOFT.A 152.4,17.78 142.24,17.78 139.7,15.24 115.57,15.24 115.57,29.21 RN3.6
SCL  (via drill 0.61)
  Top 0.254: v69.85,11.43 67.31,13.97 IC3.12 | 124.46,101.6 124.46,107.95 130.81,114.3 134.62,114.3 137.16,111.76 137.16,100.33 147.32,100.33 IC4.6 | 124.46,101.6 124.46,97.79 R2.1 | v99.06,97.79 102.87,101.6 124.46,101.6
  Bottom 0.254: v69.85,11.43 69.85,8.89 72.39,6.35 81.28,6.35 81.28,11.43 83.82,13.97 IC5.12 85.09,13.97 87.63,13.97 87.63,59.69 92.71,64.77 92.71,81.28 99.06,87.63 v99.06,97.79
SCLK  (via drill 0.61)
  Top 0.254: v115.57,76.2 115.57,78.74 118.11,81.28 120.65,81.28 132.08,92.71 IC4.16 | IC2.11 113.81,70.63 110.49,67.31 81.81,67.31 IC1.11
  Bottom 0.254: v115.57,76.2 114.3,74.93 114.3,71.12 IC2.11
SDA  (via drill 0.61)
  Top 0.254: IC3.13 67.31,11.43 72.39,6.35 78.74,6.35 83.42,11.03 IC5.13 | v109.22,99.06 110.49,100.33 119.38,100.33 120.65,99.06 120.65,97.79 R3.1
  Bottom 0.254: R3.1 120.65,97.79 128.27,105.41 128.27,111.76 130.81,114.3 143.51,114.3 143.51,102.31 IC4.5 | v109.22,99.06 109.22,87.63 95.25,73.66 95.25,66.04 88.9,59.69 88.9,11.43 85.09,11.43 IC5.13
SEL
  Top 0.254: SEL.2 140.97,57.15 138.43,54.61 131.18,54.61 126.1,49.53 109.73,49.53 94.4,34.2 94.4,32.8 92.8,31.2 91.96,31.2 IC5.24
SHIFT
  Top 0.254: IC5.25 92.71,34.29 113.32,54.9 121.2,54.9 123.25,56.95 SHIFT.2
SLOW_FAST  (via drill 0.61)
  Top 0.254: v83.82,48.26 54.61,48.26 v44.45,38.1
  Bottom 0.254: v83.82,48.26 83.82,41.91 IC5.1 | v44.45,38.1 41.91,35.56 41.91,34.29 SLOW_FAST.D
SLOW_FAST_LD  (via drill 0.61)
  Top 0.254: v95.25,52.07 v50.8,52.07
  Bottom 0.254: v50.8,52.07 43.18,44.45 SLOW_FAST.A | v95.25,52.07 105.41,41.91 105.41,30.48 RN3.2
START_STOP  (via drill 0.61)
  Top 0.254: v62.23,46.99 52.07,36.83 17.78,36.83 15.24,34.29 START_STOP.D
  Bottom 0.254: v62.23,46.99 63.5,45.72 63.5,39.8 64.4,38.9 66.12,38.9 IC3.2
START_STOP_LD  (via drill 0.61)
  Top 0.254: v50.8,49.53 16.51,49.53 16.51,44.45 START_STOP.A
  Bottom 0.254: v50.8,49.53 53.34,46.99 53.34,25.4 RN2.8
UPPER
  Bottom 0.254: RN4.3 142.24,30.48 129.54,43.18 129.54,64.77 UPPER.A
V1_LD
  Top 0.254: RN2.4 43.18,24.13 40.64,21.59 40.64,15.24 52.07,15.24 54.61,12.7 V_1.A
V2_LD
  Top 0.254: V_2.A 32.1,7 28.3,10.8 13.1,10.8 9,14.9 9,24.89 RN1.8
V3_LD
  Top 0.254: RN1.4 19.05,24.13 20.32,22.86 24.13,22.86 27.94,19.05 31.75,19.05 V_3.A
VIB_ON  (via drill 0.61)
  Top 0.254: v68.58,2.54 21.59,2.54 16.51,7.62 15.24,7.62 VIB_ON.D
  Bottom 0.254: v68.58,2.54 68.58,11.43 69.85,12.7 69.85,20.32 73.66,24.13 IC3.21
VIB_ON_LD
  Bottom 0.254: VIB_ON.A 16.51,19.05 20.32,22.86 24.13,22.86 24.13,24.13 RN1.2
VIB_TYPE  (via drill 0.61)
  Top 0.254: v67.31,54.61 v72.39,54.61
  Bottom 0.254: v72.39,54.61 76.2,50.8 76.2,38.1 74.93,36.83 IC3.26 | v67.31,54.61 57.15,44.45 57.15,22.86 49.53,15.24 46.99,15.24 44.45,12.7 44.45,11.43 41.91,8.89 41.91,7.62 VIB_SEL.D

### Text on the board
Top: VMCONNECTION DESIGN | MADE IN ITALY | BD_X_v41
tNames: PRO_MICRO | NO_LED!!!